# Altium schematic sheet BMS029B_FETs.SchDoc: FETs
size 431 x 279 mm; Date: Not shown in title block; ApprovedBy: Not shown in title block; CheckedBy: Not shown in title block; Author: Not shown in title block; CompanyName: Not shown in title block; DrawnBy: M Sunna; Engineer: Not shown in title block; Organization: Not shown in title block; Address1: Not shown in title block; Address2: Not shown in title block; Address3: Not shown in title block; Address4: Not shown in title block; DocumentNumber: 3; Revision: Use project parameter SCH_Rev; SheetNumber: 1; SheetTotal: 2; PageSetup: Record=PageOptions|CenterHorizontal=True|CenterVertical=True|PrintScale=1.00|XCorrection=1.00|YCorrection=1.00|PrintKind=0|BorderSize=5000000|LeftOffset=0|BottomOffset=0|Orientation=2|PaperLength=1000|PaperWidth=1000|Scale=100|PaperSource=15|PrintQuality=600|MediaType=1|DitherType=10|PaperKind=Letter|PrintScaleMode=1; CurrentTime: Not shown in title block; CurrentDate: Not shown in title block; Time: Not shown in title block; DocumentFullPathAndName: Not shown in title block; DocumentName: Not shown in title block; ModifiedDate: Not shown in title block; ImagePath: Not shown in title block
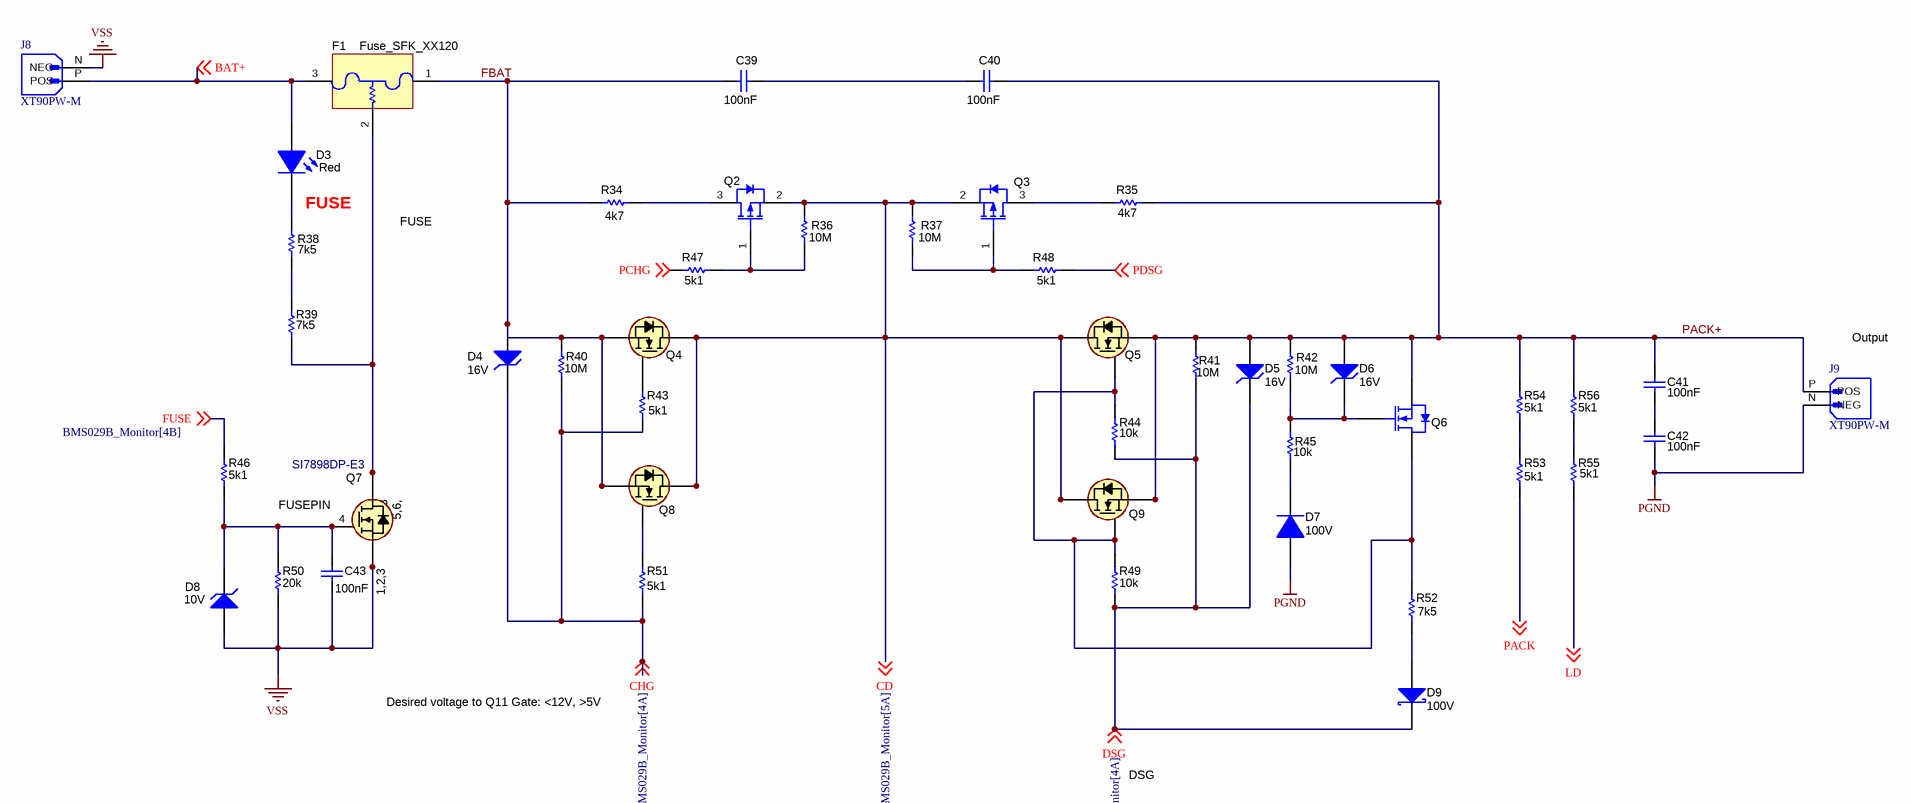
[diagram p0: BMS029B_FETs.SchDoc]

## Parts
C39  value 100nF  [c0603]  (hidden comment: C1608X7R1H224K080AB)
C40  value 100nF  [c0603]  (hidden comment: C1608X7R1H224K080AB)
C41  value 100nF  [c0603]  (hidden comment: C1608X7R1H224K080AB)
C42  value 100nF  [c0603]  (hidden comment: C1608X7R1H224K080AB)
C43  value 100nF  [c0603]  (hidden comment: C1608X7R1H224K080AB)
D3  value Red  [WL-SMCW_RED]  (hidden comment: LED SMD)
D4  value 16V  [SOD-123]  (hidden comment: MMSZ5246B-7-F)
D5  value 16V  [SOD-123]  (hidden comment: MMSZ5246B-7-F)
D6  value 16V  [SOD-123]  (hidden comment: MMSZ5246B-7-F)
D7  value 100V  [SOD-123]  (hidden comment: 1N4148W-7-F)
D8  value 10V  [SOD-123]  (hidden comment: MMSZ4697T1G)
D9  value 100V  [SOD-123]  (hidden comment: BAT46W-7-F)
F1  Fuse_SFK_XX120  [120 Amperes SFM Series Self Control Protector(SCP)]
J8  XT90PW-M  [AMASS_XT90PW-M]
J9  XT90PW-M  [AMASS_XT90PW-M]
Q2  MOSFET_P_D3G1S2  [SOT-23]  (value not drawn)
Q3  MOSFET_P_D3G1S2  [SOT-23]  (value not drawn)
Q4  BSC160N15NS5ATMA1  [PG-TDSON-8]  (value not drawn)
Q5  BSC160N15NS5ATMA1  [PG-TDSON-8]  (value not drawn)
Q6  2N7002KW  [SOT-323]  (value not drawn)
Q7  SI7898DP-E3  [PowerPAK_SO-8]
Q8  BSC160N15NS5ATMA1  [PG-TDSON-8]  (value not drawn)
Q9  BSC160N15NS5ATMA1  [PG-TDSON-8]  (value not drawn)
R34  4k7  [2512]
R35  4k7  [2512]
R36  10M  [SMD 0805 res]
R37  10M  [SMD 0805 res]
R38  value 7k5  [SMD 0805 res]  (hidden comment: 0805_res)
R39  value 7k5  [SMD 0805 res]  (hidden comment: 0805_res)
R40  10M  [SMD 0805 res]
R41  10M  [SMD 0805 res]
R42  10M  [SMD 0805 res]
R43  value 5k1  [SMD 0805 res]  (hidden comment: 0805_res)
R44  value 10k  [SMD 0805 res]  (hidden comment: Resistor)
R45  value 10k  [SMD 0805 res]  (hidden comment: Resistor)
R46  value 5k1  [SMD 0805 res]  (hidden comment: 0805_res)
R47  value 5k1  [SMD 0805 res]  (hidden comment: 0805_res)
R48  value 5k1  [SMD 0805 res]  (hidden comment: 0805_res)
R49  value 10k  [SMD 0805 res]  (hidden comment: Resistor)
R50  value 20k  [SMD 0805 res]  (hidden comment: 0805_res)
R51  value 5k1  [SMD 0805 res]  (hidden comment: 0805_res)
R52  value 7k5  [0603S]  (hidden comment: Resistor_0603)
R53  value 5k1  [SMD 0805 res]  (hidden comment: 0805_res)
R54  value 5k1  [SMD 0805 res]  (hidden comment: 0805_res)
R55  value 5k1  [SMD 0805 res]  (hidden comment: 0805_res)
R56  value 5k1  [SMD 0805 res]  (hidden comment: 0805_res)

## Nets
PGND: C42.2 D7.2(A) J9.N(NEG)
VSS: C43.1 D8.2(A) J8.N(NEG) Q7.1(S) Q7.2(S) Q7.3(S) R50.2
BAT+: D3.2(A) F1.3(Fuse) J8.P(POS) ; off-sheet BAT+
CD: Q2.2(S) Q3.2(S) Q4.5(D) Q4.6(D) Q4.7(D) Q4.8(D) Q4.9(D) Q5.5(D) Q5.6(D) Q5.7(D) Q5.8(D) Q5.9(D) Q8.5(D) Q8.6(D) Q8.7(D) Q8.8(D) Q8.9(D) Q9.5(D) Q9.6(D) Q9.7(D) Q9.8(D) Q9.9(D) R36.2 R37.2 ; off-sheet CD
CHG: D4.1(K) R40.1 R43.2 R51.2 ; off-sheet CHG
DSG: D5.1(K) D9.1(K) R41.1 R44.2 R49.2 ; off-sheet DSG
FBAT: C39.2 D4.2(A) F1.1(Fuse) Q4.1(S) Q4.2(S) Q4.3(S) Q8.1(S) Q8.2(S) Q8.3(S) R34.1 R40.2
FUSE: R46.1 ; off-sheet FUSE
LD: R55.2 ; off-sheet LD
PACK: R53.2 ; off-sheet PACK
PACK+: C40.1 C41.1 D5.2(A) D6.2(A) J9.P(POS) Q5.1(S) Q5.2(S) Q5.3(S) Q6.2(S) Q9.1(S) Q9.2(S) Q9.3(S) R35.2 R41.2 R42.2 R54.1 R56.1
PCHG: R47.1 ; off-sheet PCHG
PDSG: R48.2 ; off-sheet PDSG
NetC39_1: C39.1 C40.2
NetC41_2: C41.2 C42.1
NetC43_2: C43.2 D8.1(K) Q7.4(G) R46.2 R50.1
NetD3_1: D3.1(K) R38.2
NetD6_1: D6.1(K) Q6.1(G) R42.1 R45.2
NetD7_1: D7.1(K) R45.1
NetD9_2: D9.2(A) R52.2
NetF1_2: F1.2(Heater) Q7.5(D) Q7.6(D) Q7.7(D) Q7.8(D) Q7.9(D) R39.1
NetQ2_1: Q2.1(G) R36.1 R47.2
NetQ2_3: Q2.3(D) R34.2
NetQ3_1: Q3.1(G) R37.1 R48.1
NetQ3_3: Q3.3(D) R35.1
NetQ4_4: Q4.4(G) R43.1
NetQ5_4: Q5.4(G) Q6.3(D) Q9.4(G) R44.1 R49.1 R52.1
NetQ8_4: Q8.4(G) R51.1
NetR38_1: R38.1 R39.2
NetR53_1: R53.1 R54.2
NetR55_1: R55.1 R56.2

## Notes on the sheet
- FUSE
- (near J9) Output
- FUSEPIN
- Desired voltage to Q11 Gate: <12V, >5V
- DSG
- (in symbol SI7898DP-E3) 7,8; 5,6,; 1,2,3

## Library data of the parts
C39 C40 = Capacitor: CAP, CERM, 0.22 uF, 50 V, +/- 10%, X7R, 0603; Manufacturer: TDK; TaMin_C: -55°C; Polarized: N; SizeAreaWB_mm2: 4.68; Value1: 0.021699 ohm; U/M: EA; TaMax_C: 125°C; SizeZ_mm: 1; SizeX_mm: 1.6; SizeY_mm: 0.8; Cap_Case: 0603; Value2: 50V; SizeArea_mm2: 1.28; AEC Category: Q200; ValueDisplayed: 0.22uF; ESR_ohm: 0.021699; IRMS_A: 1.12496A; Supplier Part Number 2: 04X3259; Publisher: Texas Instruments; Supplier 2: Newark; TempCo: X7R; Published: 2008-06-19; RoHS: Y; MountType: SMT; Supplier 1: Digi-Key; PackageReference: 0603; Tolerance_%: 10%; CompType: Capacitor; LatestRevisionDate: 2017-03-09; PartNumber: C1608X7R1H224K080AB; AEC Qualified: N; VDC_V: 50V; ComponentLink1Description: Datasheet link; AEC Grade: N/A; Supplier Part Number 1: 445-7408-1-ND; Technology: Ceramic; ComponentLink1URL: https://product.tdk.com/en/search/capacitor/ceramic/mlcc/info?part_no=C1608X7R1H224K080AB; Supplier 3: Mouser; Supplier Part Number 3: 810-C1608X7R1H224K
C41 C42 = Capacitor: CAP, CERM, 0.22 uF, 50 V, +/- 10%, X7R, 0603; Manufacturer: TDK; TaMin_C: -55°C; Polarized: N; SizeAreaWB_mm2: 4.68; Value1: 0.021699 ohm; U/M: EA; TaMax_C: 125°C; SizeZ_mm: 1; SizeX_mm: 1.6; SizeY_mm: 0.8; Cap_Case: 0603; Value2: 50V; SizeArea_mm2: 1.28; Cap_F: 220nF; AEC Category: Q200; ValueDisplayed: 0.22uF; ESR_ohm: 0.021699; IRMS_A: 1.12496A; Supplier Part Number 2: 04X3259; Publisher: Texas Instruments; Supplier 2: Newark; TempCo: X7R; Published: 2008-06-19; RoHS: Y; MountType: SMT; Supplier 1: Digi-Key; PackageReference: 0603; Tolerance_%: 10%; CompType: Capacitor; LatestRevisionDate: 2017-03-09; PartNumber: C1608X7R1H224K080AB; AEC Qualified: N; VDC_V: 50V; ComponentLink1Description: Datasheet link; AEC Grade: N/A; Supplier Part Number 1: 445-7408-1-ND; Technology: Ceramic; ComponentLink1URL: https://product.tdk.com/en/search/capacitor/ceramic/mlcc/info?part_no=C1608X7R1H224K080AB; Supplier 3: Mouser; Supplier Part Number 3: 810-C1608X7R1H224K
C43 = Capacitor: CAP, CERM, 0.22 uF, 50 V, +/- 10%, X7R, 0603; Manufacturer: TDK; Polarized: N; ValueDisplayed: 0.22uF; U/M: EA; Cap_F: 220nF; ESR_ohm: 0.021699; Value1: 0.021699 ohm; VDC_V: 50V; IRMS_A: 1.12496A; TaMin_C: -55°C; TaMax_C: 125°C; Cap_Case: 0603; SizeArea_mm2: 1.28; SizeAreaWB_mm2: 4.68; SizeX_mm: 1.6; SizeY_mm: 0.8; SizeZ_mm: 1; AEC Category: Q200; CompType: Capacitor; PartNumber: C1608X7R1H224K080AB; PackageReference: 0603; RoHS: Y; Tolerance_%: 10%; Value2: 50V; MountType: SMT; Technology: Ceramic; TempCo: X7R; Published: 2008-06-19; Publisher: Texas Instruments; LatestRevisionDate: 2017-03-09; ComponentLink1Description: Datasheet link; ComponentLink1URL: https://product.tdk.com/en/search/capacitor/ceramic/mlcc/info?part_no=C1608X7R1H224K080AB; Supplier 1: Digi-Key; Supplier Part Number 1: 445-7408-1-ND; Supplier 2: Newark; Supplier Part Number 2: 04X3259; Supplier 3: Mouser; Supplier Part Number 3: 810-C1608X7R1H224K; AEC Qualified: N; AEC Grade: N/A
D3 = CMP-0002947-3: LED, Red, SMD; Manufacturer: Wurth Elektronik; PartNumber: 150060RS75000; Type: AlInGaP; Vf_V: 2V; Io_A: 30mA; Vr_V: 5V; Tjmax_C: 85°C; Power_TotalModule: 72mW; Value1: 0.072W; Angle: 140; CompType: LED; MountType: SMT; RoHS: Y; PackageReference: LED_0603; Value2: 2V; Color: Red; ComponentLink1URL: http://katalog.we-online.de/led/datasheet/150060RS75000.pdf; ComponentLink1Description: Datasheet link
D4 = Zener: Diode, Zener, 16 V, 500 mW, SOD-123; Manufacturer: Diodes Inc.; Power_W: 500mW; SizeAreaWB_mm2: 13.095; Value1: 0.5W; RJA_CperW: 350; SizeZ_mm: 1.35; SizeX_mm: 3.85; SizeY_mm: 1.7; SizeArea_mm2: 6.545; AEC Category: Q101; Vz_V: 16V; RoHS: Y; MountType: SMT; PackageReference: SOD-123; CompType: Zener; PartNumber: MMSZ5246B-7-F; AEC Qualified: ?; ComponentLink1Description: Datasheet link; ComponentLink1URL: http://www.diodes.com/datasheets/ds18010.pdf
D5 D6 = Zener: Diode, Zener, 16 V, 500 mW, SOD-123; Manufacturer: Diodes Inc.; Power_W: 500mW; SizeY_mm: 1.7; Value1: 0.5W; SizeX_mm: 3.85; RJA_CperW: 350; SizeAreaWB_mm2: 13.095; SizeArea_mm2: 6.545; AEC Category: Q101; SizeZ_mm: 1.35; MountType: SMT; Vz_V: 16V; PackageReference: SOD-123; PartNumber: MMSZ5246B-7-F; AEC Qualified: ?; CompType: Zener; ComponentLink1Description: Datasheet link; RoHS: Y; ComponentLink1URL: http://www.diodes.com/datasheets/ds18010.pdf
D7 = CMP-0029001-2: Diode, Ultrafast, 100 V, 0.15 A, SOD-123; Manufacturer: Diodes Inc.; Vf_V: 1.25V; Value1: 0.15A; Io_A: 1.5dA; TJmax_C: 150°C; SizeAreaWB_mm2: 13.095; SizeArea_mm2: 6.545; SizeX_mm: 3.85; SizeY_mm: 1.7; SizeZ_mm: 1.35; AEC Category: Q101; Green_Lifecycle: Active; Green_REACh: Passed; PartNumber: 1N4148W-7-F; PackageReference: SOD-123; CompType: Diode; Value2: 1.25V; Vr_V: 100V; MountType: SMT; Type: Ultrafast; RoHS: Y; ComponentLink1Description: Datasheet link; ComponentLink1URL: http://www.diodes.com/datasheets/ds30086.pdf; AEC Qualified: ?; Green_EU RoHS: Passed; Green_EU RoHS-2: Passed
D8 = Zener: Diode, Zener, 16 V, 500 mW, SOD-123; Manufacturer: Diodes Inc.; PartNumber: MMSZ5246B-7-F; SizeY_mm: 1.7; SizeX_mm: 3.85; RJA_CperW: 350; SizeAreaWB_mm2: 13.095; AEC Category: Q101; Power_W: 500mW; SizeZ_mm: 1.35; Vz_V: 16V; Value1: 0.5W; SizeArea_mm2: 6.545; PackageReference: SOD-123; AEC Qualified: ?; MountType: SMT; RoHS: Y; ComponentLink1Description: Datasheet link; CompType: Zener; ComponentLink1URL: http://www.diodes.com/datasheets/ds18010.pdf
D9 = DIODE_SCHOTTKY: Diode, Schottky, 100 V, 0.15 A, SOD-123; Manufacturer: Diodes Inc.; Io_A: 150mA; SizeArea_mm2: 6.545; SizeX_mm: 3.85; Value2: 0.6V; Value1: 0.15A; AEC Category: Q101; SizeZ_mm: 1.35; SizeY_mm: 1.7; Green_Lifecycle: Active; Green_REACh: Passed; SizeAreaWB_mm2: 13.095; Vf_V: 600mV; ComponentLink1Description: Datasheet link; MountType: SMT; ComponentLink1URL: http://www.diodes.com/datasheets/ds30044.pdf; Vr_V: 100V; PartNumber: BAT46W-7-F; Type: Schottky; AEC Qualified: ?; Green_EU RoHS-2: Passed; Green_EU RoHS: Passed; CompType: Diode; RoHS: Y; PackageReference: SOD-123
F1 = SFM-12120: 120 Amperes SFM Series Self Control Protector(SCP); Manufacturer: Dexerials Corporation; Irating_A: 30A; CompType: Fuse; VDC_V: 62V; Rtyp_Ohm: 1.75m; PartNumber: SFK-3030; PackageReference: 9.5x2x5mm; ComponentLink1Description: Datasheet URL; MountType: SMT; ComponentLink1URL: https://sps16.itg.ti.com/sites/KMS/crossdivteams/altium/docs/ComponentDatasheets/Dexerials_SFK-xx30x.pdf; RoHS: Y
J8 J9 = XT90PW-M: Socket; DC supply; XT90; male; PIN: 2; on PCBs; THT; Colour: yellow; MF: AMASS; SnapEDA_Link: https://www.snapeda.com/parts/XT90PW-M/AMASS/view-part/?ref=snap; Package: Package; Value: *; MP: XT90PW-M; Check_prices: https://www.snapeda.com/parts/XT90PW-M/AMASS/view-part/?ref=eda
Q2 Q3 = MOSFET_P_D3G1S2: MOSFET, P-CH, -150 V, -0.53 A, SOT-23
Q4 Q5 Q8 Q9 = MOSFET_N_D56789G: MOSFET, N-CH, 150 V, 56 A, PG-TDSON-8; Alternate Manufacturer: None; Manufacturer: Infineon Technologies; QgTyp_nC: 19.0; SizeAreaWB_mm2: 55.131; Vgs_V: 20V; Value1: ? ohm; VdsMax_V: 150V; U/M: EA; Value: 150V; IdsMax_A: 56A; SizeZ_mm: 1.12; SizeX_mm: 5.99; SizeY_mm: 4.9; Value2: 19 nC; SizeArea_mm2: 29.351; ChType: N; AEC Category: Q101; ComponentLink1URL: http://www.infineon.com/dgdl/Infineon-BSC160N15NS5-DS-v02_02-EN.pdf?fileId=5546d46253f650570154a055b7215b1b; Supplier Part Number 2: 726-BSC160N15NS5ATM; Publisher: Texas Instruments; Supplier 2: Mouser; Published: 2008-06-19; RoHS: Y; MountType: SMT; Supplier 1: Digi-Key; LatestRevisionNote: Added parts.; PackageReference: PG-TDSON-8; CompType: MOSFET; LatestRevisionDate: 2017-06-05; PartNumber: BSC160N15NS5ATMA1; AEC Qualified: N; ComponentLink1Description: Datasheet link; Supplier Part Number 1: BSC160N15NS5ATMA1-ND
Q6 = CMP-0000774-1: MOSFET, N-CH, 60 V, 0.31 A, SOT-323; Manufacturer: Fairchild Semiconductor; Alternate Manufacturer: None; Value: 60V; U/M: EA; ChType: N; Value1: 1; Rdson45_ohm: 1.6; Vgs_V: 2.1V; IdsMax_A: 3.1dA; SizeAreaWB_mm2: 10.24; SizeArea_mm2: 4.84; SizeX_mm: 2.2; SizeZ_mm: 1.1; AEC Category: Q101; Green_Lifecycle: Active; Green_REACh: Passed; SymbolVersion: 2008-07-28; CompType: MOSFET; PartNumber: 2N7002KW; PackageReference: SOT-323; VdsMax_V: 60V; RoHS: Y; MountType: SMT; Published: 2008-06-19; Publisher: Texas Instruments; LatestRevisionDate: 2017-03-09; LatestRevisionNote: Added parts.; ComponentLink1Description: Datasheet link; ComponentLink1URL: http://www.fairchildsemi.com/ds/2N/2N7002KW.pdf; Supplier 1: Digi-Key; Supplier Part Number 1: 2N7002KWCT-ND; Supplier 2: Mouser; Supplier Part Number 2: 512-2N7002KW; SizeY_mm: 2.2; AEC Qualified: ?; Green_EU RoHS: Passed; Green_EU RoHS-2: Passed
Q7 = SI7898DP-E3: MOSFET, N-CH, 150 V, 13 A, PowerPACK SO-8; Alternate Manufacturer: None; Manufacturer: Infineon Technologies; PartNumber: BSZ900N15NS3 G; QgTyp_nC: 5; SizeAreaWB_mm2: 19.36; Vgs_V: 20V; VdsMax_V: 150V; U/M: EA; Value: 150V; IdsMax_A: 13A; SizeZ_mm: 1.1; SizeX_mm: 3.4; Value2: 5 nC; SizeArea_mm2: 11.56; ChType: N; AEC Category: Q101; ComponentLink1URL: http://www.infineon.com/dgdl/BSZ900N15NS3+Rev2.1_.pdf?folderId=db3a304326623792012669f6bee2224b&fileId=db3a304326623792012669f7decc224c; Supplier Part Number 2: 726-BSZ900N15NS3G; Publisher: Texas Instruments; Supplier 2: Mouser; Published: 2008-06-19; RoHS: Y; MountType: SMT; Supplier 1: Digi-Key; LatestRevisionNote: Added parts.; PackageReference: PG-TSDSON-8; SizeY_mm: 3.4; CompType: MOSFET; LatestRevisionDate: 2017-03-09; AEC Qualified: ?; ComponentLink1Description: Datasheet link; Supplier Part Number 1: BSZ900N15NS3 GCT-ND
R34 R35 = Resistor_2512: RES, 20.0, 1%, 0.25 W, AEC-Q200 Grade 0, 1206; Manufacturer: Vishay-Dale; PartNumber: CRCW120620R0FKEA; Power_W: 250mW; TempCo: 100 ppm/C; Value_Code: 20R0; EIA_Code: E96; Res_ohm: 20; SizeX_mm: 3.2; SizeY_mm: 1.6; SizeZ_mm: 1.35; Value2: 0.25W; SizeArea_mm2: 5.12; AEC Qualified: Y; VDC_V: 200V; AEC Grade: 0; AEC Category: Q200; RoHS: E; Value1: 1%; MountType: SMT; Value: 4k7; Supplier 1: Digi-Key; PackageReference: 1206; Tolerance_%: 1%; CompType: Resistor; ComponentLink1Description: Datasheet link; Supplier Part Number 1: 541-20.0FCT-ND; Technology: Thick Film; ComponentLink1URL: http://www.vishay.com/docs/20035/dcrcwe3.pdf; Supplier 2: Newark; Supplier 3: Mouser; Supplier Part Number 2: 42K4894; Supplier Part Number 3: 71-CRCW1206-20-E3
R36 R37 R41 R42 R45 R46 R50 = Resistor_0805: 0.25 W, AEC-Q200 Grade 0, 0805; PartNumber: CRCW120620R0FKEA; Manufacturer: Vishay-Dale; Res_ohm: 20; Value_Code: 20R0; Tolerance_%: 1%; Power_W: 250mW; Value2: 0.25W; VDC_V: 200V; TempCo: 100 ppm/C; EIA_Code: E96; SizeArea_mm2: 5.12; SizeX_mm: 3.2; SizeY_mm: 1.6; SizeZ_mm: 1.35; AEC Category: Q200; AEC Qualified: Y; AEC Grade: 0; CompType: Resistor; PackageReference: 1206; RoHS: E; Value1: 1%; MountType: SMT; Technology: Thick Film; ComponentLink1Description: Datasheet link; ComponentLink1URL: http://www.vishay.com/docs/20035/dcrcwe3.pdf; Supplier 1: Digi-Key; Supplier Part Number 1: 541-20.0FCT-ND; Supplier 2: Newark; Supplier Part Number 2: 42K4894; Supplier 3: Mouser; Supplier Part Number 3: 71-CRCW1206-20-E3
  R36 R37 R41 R42: Value: 10M
R38 R39 = Resistor_0805: 0.25 W, AEC-Q200 Grade 0, 0805; Manufacturer: Vishay-Dale; PartNumber: CRCW120620R0FKEA; Power_W: 250mW; TempCo: 100 ppm/C; Value_Code: 20R0; Value1: 1%; EIA_Code: E96; Res_ohm: 20; SizeX_mm: 3.2; SizeY_mm: 1.6; SizeZ_mm: 1.35; Value2: 0.25W; SizeArea_mm2: 5.12; AEC Qualified: Y; VDC_V: 200V; AEC Category: Q200; AEC Grade: 0; Supplier Part Number 2: 42K4894; Supplier 2: Newark; Supplier Part Number 3: 71-CRCW1206-20-E3; Supplier 3: Mouser; RoHS: E; MountType: SMT; Supplier 1: Digi-Key; PackageReference: 1206; Tolerance_%: 1%; CompType: Resistor; ComponentLink1Description: Datasheet link; Supplier Part Number 1: 541-20.0FCT-ND; Technology: Thick Film; ComponentLink1URL: http://www.vishay.com/docs/20035/dcrcwe3.pdf
R40 = Resistor_0805: 0.25 W, AEC-Q200 Grade 0, 0805; PartNumber: CRCW120620R0FKEA; Manufacturer: Vishay-Dale; Value: 20.0; Res_ohm: 20; Value_Code: 20R0; Tolerance_%: 1%; Power_W: 250mW; Value2: 0.25W; VDC_V: 200V; TempCo: 100 ppm/C; EIA_Code: E96; SizeArea_mm2: 5.12; SizeX_mm: 3.2; SizeY_mm: 1.6; SizeZ_mm: 1.35; AEC Category: Q200; AEC Qualified: Y; AEC Grade: 0; CompType: Resistor; PackageReference: 1206; RoHS: E; Value1: 1%; MountType: SMT; Technology: Thick Film; ComponentLink1Description: Datasheet link; ComponentLink1URL: http://www.vishay.com/docs/20035/dcrcwe3.pdf; Supplier 1: Digi-Key; Supplier Part Number 1: 541-20.0FCT-ND; Supplier 2: Newark; Supplier Part Number 2: 42K4894; Supplier 3: Mouser; Supplier Part Number 3: 71-CRCW1206-20-E3
R43 R44 R47-R49 R51 R53-R56 = Resistor_0805: 0.25 W, AEC-Q200 Grade 0, 0805; PartNumber: CRCW120620R0FKEA; Manufacturer: Vishay-Dale; Res_ohm: 20; Value_Code: 20R0; Tolerance_%: 1%; Power_W: 250mW; Value2: 0.25W; VDC_V: 200V; TempCo: 100 ppm/C; SizeArea_mm2: 5.12; SizeX_mm: 3.2; SizeY_mm: 1.6; SizeZ_mm: 1.35; EIA_Code: E96; AEC Category: Q200; AEC Qualified: Y; AEC Grade: 0; CompType: Resistor; PackageReference: 1206; RoHS: E; Value1: 1%; MountType: SMT; Technology: Thick Film; ComponentLink1Description: Datasheet link; ComponentLink1URL: http://www.vishay.com/docs/20035/dcrcwe3.pdf; Supplier 1: Digi-Key; Supplier Part Number 1: 541-20.0FCT-ND; Supplier 2: Newark; Supplier Part Number 2: 42K4894; Supplier 3: Mouser; Supplier Part Number 3: 71-CRCW1206-20-E3
R52 = Resistor_0603: RES, 100, 5%, 0.1 W, AEC-Q200 Grade 0, 0603; Manufacturer: Vishay-Dale; PartNumber: CRCW0603100RJNEA; Power_W: 100mW; TempCo: 200 ppm/C; Value_Code: 100R; EIA_Code: E24; Res_ohm: 100; SizeX_mm: 1.6; SizeY_mm: 0.8; SizeZ_mm: 1; Value2: 0.1W; SizeArea_mm2: 1.28; AEC Qualified: Y; VDC_V: 75V; AEC Category: Q200; AEC Grade: 0; U/M: EA; Supplier Part Number 2: 59M6764; Supplier 2: Newark; Supplier Part Number 3: 71-CRCW0603J-100-E3; Supplier 3: Mouser; RoHS: E; Value1: 5%; MountType: SMT; Supplier 1: Digi-Key; PackageReference: 0603; Tolerance_%: 5%; CompType: Resistor; ComponentLink1Description: Datasheet link; Supplier Part Number 1: 541-100GCT-ND; Technology: Thick Film; ComponentLink1URL: http://www.vishay.com/docs/20035/dcrcwe3.pdf; SymbolVersion: 2009-05-29; Published: 2008-06-26; Publisher: Texas Instruments; LatestRevisionDate: 2017-06-13